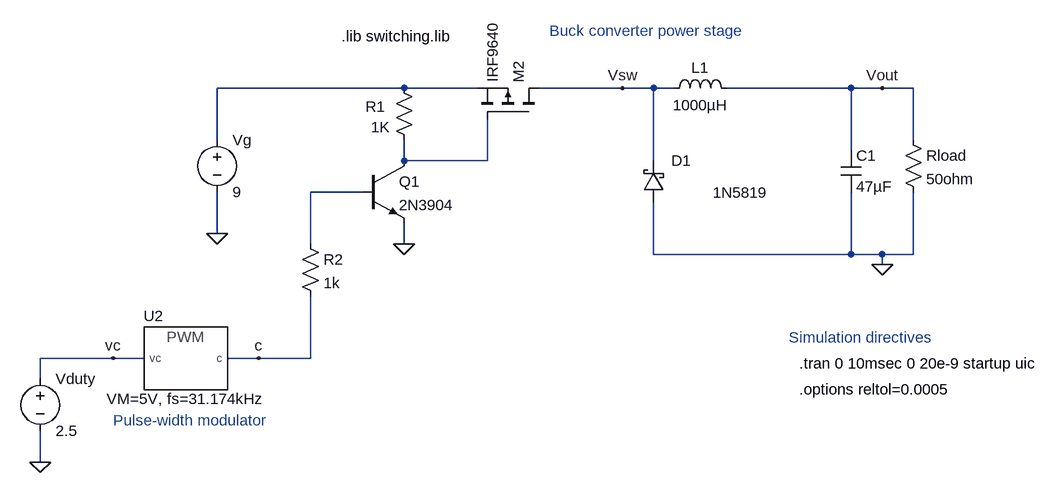
[diagram p0: schematic buck.asc]
buck.asc, the LTspice schematic file:
Version 4
SHEET 1 1616 680
WIRE 464 -352 176 -352
WIRE 576 -352 464 -352
WIRE 800 -352 672 -352
WIRE 848 -352 800 -352
WIRE 880 -352 848 -352
WIRE 1152 -352 960 -352
WIRE 1200 -352 1152 -352
WIRE 1248 -352 1200 -352
WIRE 176 -272 176 -352
WIRE 1248 -272 1248 -352
WIRE 1152 -256 1152 -352
WIRE 464 -240 464 -272
WIRE 592 -240 592 -304
WIRE 592 -240 464 -240
WIRE 848 -240 848 -352
WIRE 400 -192 320 -192
WIRE 176 -128 176 -192
WIRE 320 -112 320 -192
WIRE 464 -112 464 -144
WIRE 848 -96 848 -176
WIRE 1152 -96 1152 -192
WIRE 1152 -96 848 -96
WIRE 1200 -96 1152 -96
WIRE 1248 -96 1248 -192
WIRE 1248 -96 1200 -96
WIRE 1200 -80 1200 -96
WIRE 16 64 -96 64
WIRE 64 64 16 64
WIRE 240 64 192 64
WIRE 320 64 320 -32
WIRE 320 64 240 64
WIRE -96 96 -96 64
WIRE -96 224 -96 176
FLAG -96 224 0
FLAG 1200 -80 0
FLAG 176 -128 0
FLAG 1200 -352 Vout
FLAG 464 -112 0
FLAG 800 -352 Vsw
FLAG 16 64 vc
FLAG 240 64 c
SYMBOL voltage -96 80 R0
SYMATTR InstName Vduty
SYMATTR Value 2.5
SYMBOL schottky 864 -176 R180
WINDOW 0 -42 64 Left 2
WINDOW 3 -160 15 Left 2
SYMATTR InstName D1
SYMATTR Value 1N5819
SYMATTR Description Diode
SYMATTR Type diode
SYMBOL cap 1136 -256 R0
SYMATTR InstName C1
SYMATTR Value 47µF
SYMBOL res 1232 -288 R0
SYMATTR InstName Rload
SYMATTR Value 50ohm
SYMBOL ind 864 -336 R270
WINDOW 0 32 56 VTop 2
WINDOW 3 5 56 VBottom 2
SYMATTR InstName L1
SYMATTR Value 1000µH
SYMBOL voltage 176 -288 R0
SYMATTR InstName Vg
SYMATTR Value 9
SYMBOL res 448 -368 R0
WINDOW 0 -43 45 Left 2
WINDOW 3 -35 76 Left 2
SYMATTR InstName R1
SYMATTR Value 1K
SYMBOL PWM 128 64 R0
SYMATTR InstName U2
SYMATTR SpiceLine2 Dmin=0, Dmax=1, Voffset=0
SYMATTR SpiceLine VM=5V, fs=31.174kHz
SYMBOL pmos 672 -304 M270
SYMATTR InstName M2
SYMATTR Value IRF9640
SYMBOL npn 400 -240 R0
SYMATTR InstName Q1
SYMATTR Value 2N3904
SYMBOL res 304 -128 R0
SYMATTR InstName R2
SYMATTR Value 1k
TEXT 1072 72 Left 2 !.tran 0 10msec 0 20e-9 startup uic
TEXT 688 -440 Left 2 ;Buck converter power stage
TEXT 16 160 Left 2 ;Pulse-width modulator
TEXT 1056 32 Left 2 ;Simulation directives
TEXT 368 -432 Left 2 !.lib switching.lib
TEXT 1072 112 Left 2 !.options reltol=0.0005

The netlist it stands for:
* buck.asc
Vduty vc 0 2.5
D1 0 Vsw 1N5819
C1 Vout 0 47µF
Rload Vout 0 50ohm
L1 Vsw Vout 1000µH
Vg N001 0 9
R1 N001 N002 1K
XU2 vc c PWM VM=5V, fs=31.174kHz Dmin=0, Dmax=1, Voffset=0  ; pins vc c
M2 Vsw N002 N001 N001 IRF9640
Q1 N002 N003 0 0 2N3904
R2 N003 c 1k
.model D D
.lib standard.dio
.model NPN NPN
.model PNP PNP
.lib standard.bjt
.model NMOS NMOS
.model PMOS PMOS
.lib standard.mos
.tran 0 10msec 0 20e-9 startup uic
* Buck converter power stage
* Pulse-width modulator
* Simulation directives
.lib switching.lib
.options reltol=0.0005
.backanno
.end